# Altium project sommotor.PrjPcb (part 1 of 2)
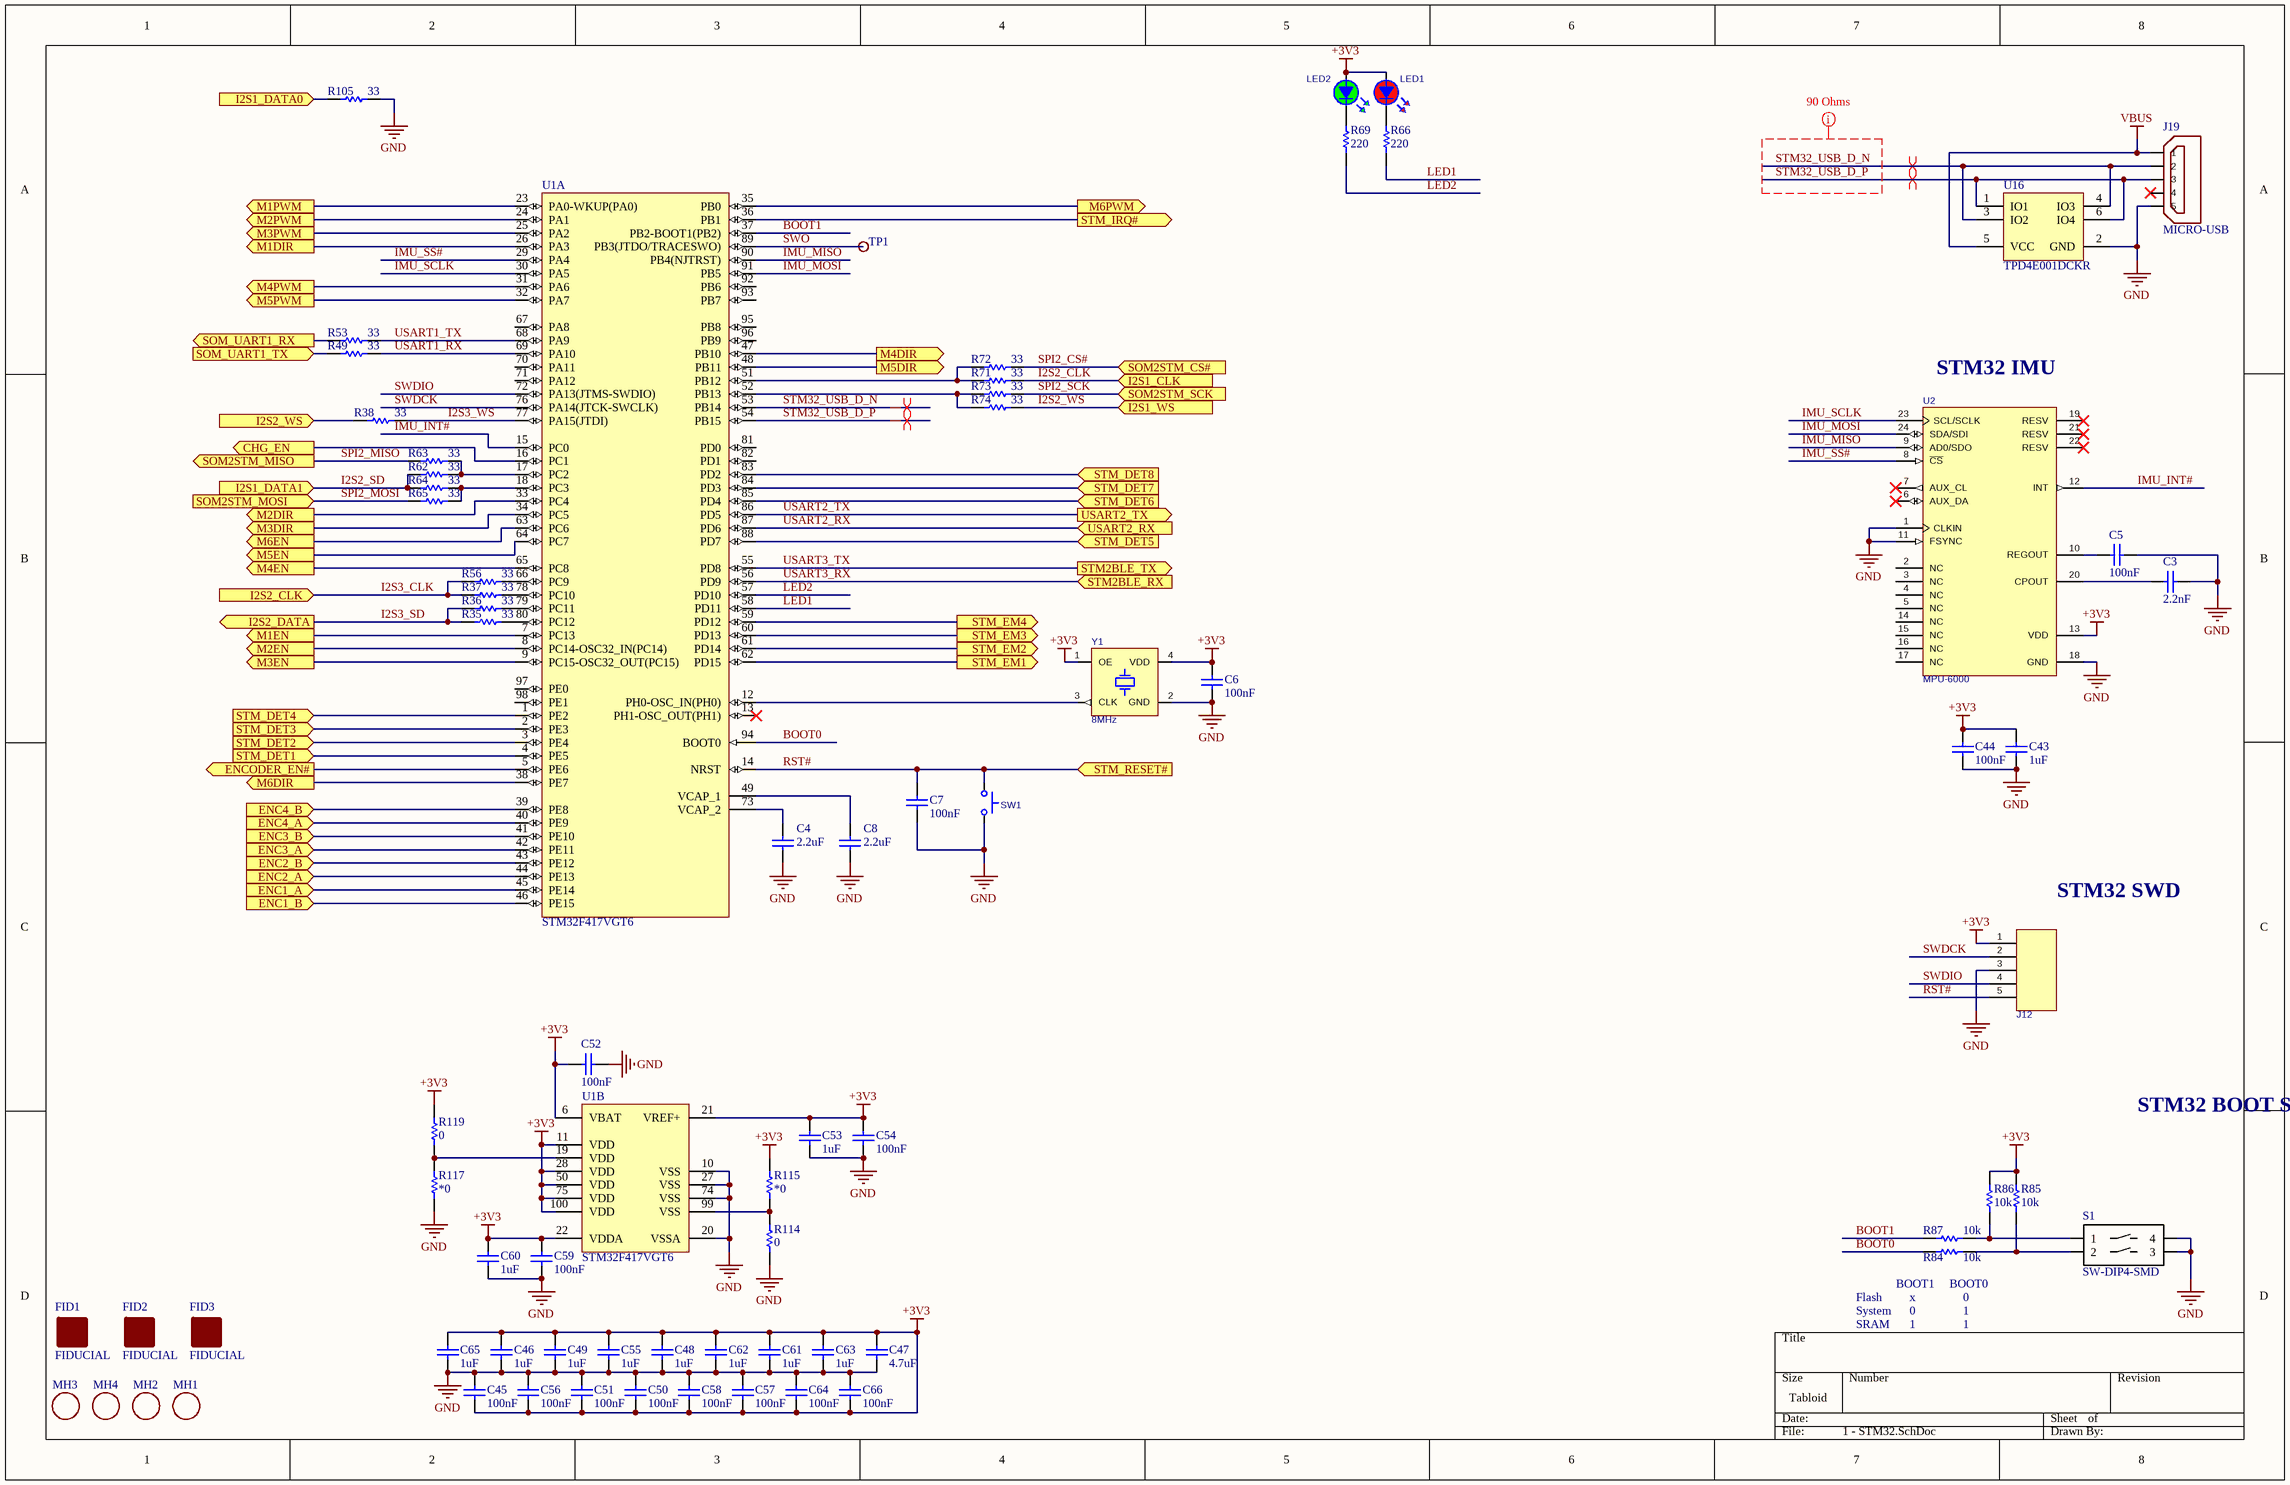
[diagram p0: 1 - STM32.SchDoc]
5 sheets, 285 parts. Net scope: flat (ports and power ports of the same name join across sheets).
Board file: sommotor.PcbDoc
Sheets:
  1 - STM32.SchDoc
  5 - PWM Steering.SchDoc
  2 - BLE.SchDoc
  3 - Motor Drivers.SchDoc
  4 - Connectors.SchDoc

## Sheet 1 - STM32.SchDoc
size Tabloid

### Parts
(Parts that share a designator on the sheet are numbered #1, #2 ... from top to bottom, then left to right.)
C3  value 2.2nF  [CAPC0805(2012)100_L]
C4  value 2.2uF  [CAPC0805(2012)100_L]  (hidden comment: CAP 2.2uF 6.3V 0805(2012))
C5  value 100nF  [CAPC0805(2012)100_L]  (hidden comment: CAP 100nF 6.3V 0805(2012))
C6  value 100nF  [CAPC0805(2012)100_L]  (hidden comment: CAP 100nF 6.3V 0805(2012))
C7  value 100nF  [CAPC0805(2012)100_L]  (hidden comment: CAP 100nF 6.3V 0805(2012))
C8  value 2.2uF  [CAPC0805(2012)100_L]  (hidden comment: CAP 2.2uF 6.3V 0805(2012))
C43  value 1uF  [CAPC0805(2012)100_L]  (hidden comment: CAP 1uF 6.3V 0805(2012))
C44  value 100nF  [CAPC0805(2012)100_L]  (hidden comment: CAP 100nF 6.3V 0805(2012))
C45  value 100nF  [CAPC0805(2012)100_L]  (hidden comment: CAP 100nF 6.3V 0805(2012))
C46  value 1uF  [CAPC0805(2012)100_L]  (hidden comment: CAP 1uF 6.3V 0805(2012))
C47  value 4.7uF  [CAPC0805(2012)100_L]  (hidden comment: CAP 4.7uF 6.3V 0805(2012))
C48  value 1uF  [CAPC0805(2012)100_L]  (hidden comment: CAP 1uF 6.3V 0805(2012))
C49  value 1uF  [CAPC0805(2012)100_L]  (hidden comment: CAP 1uF 6.3V 0805(2012))
C50  value 100nF  [CAPC0805(2012)100_L]  (hidden comment: CAP 100nF 6.3V 0805(2012))
C51  value 100nF  [CAPC0805(2012)100_L]  (hidden comment: CAP 100nF 6.3V 0805(2012))
C52  value 100nF  [CAPC0805(2012)100_L]  (hidden comment: CAP 100nF 6.3V 0805(2012))
C53  value 1uF  [CAPC0805(2012)100_L]  (hidden comment: CAP 1uF 6.3V 0805(2012))
C54  value 100nF  [CAPC0805(2012)100_L]  (hidden comment: CAP 100nF 6.3V 0805(2012))
C55  value 1uF  [CAPC0805(2012)100_L]  (hidden comment: CAP 1uF 6.3V 0805(2012))
C56  value 100nF  [CAPC0805(2012)100_L]  (hidden comment: CAP 100nF 6.3V 0805(2012))
C57  value 100nF  [CAPC0805(2012)100_L]  (hidden comment: CAP 100nF 6.3V 0805(2012))
C58  value 100nF  [CAPC0805(2012)100_L]  (hidden comment: CAP 100nF 6.3V 0805(2012))
C59  value 100nF  [CAPC0805(2012)100_L]  (hidden comment: CAP 100nF 6.3V 0805(2012))
C60  value 1uF  [CAPC0805(2012)100_L]  (hidden comment: CAP 1uF 6.3V 0805(2012))
C61  value 1uF  [CAPC0805(2012)100_L]  (hidden comment: CAP 1uF 6.3V 0805(2012))
C62  value 1uF  [CAPC0805(2012)100_L]  (hidden comment: CAP 1uF 6.3V 0805(2012))
C63  value 1uF  [CAPC0805(2012)100_L]  (hidden comment: CAP 1uF 6.3V 0805(2012))
C64  value 100nF  [CAPC0805(2012)100_L]  (hidden comment: CAP 100nF 6.3V 0805(2012))
C65  value 1uF  [CAPC0805(2012)100_L]  (hidden comment: CAP 1uF 6.3V 0805(2012))
C66  value 100nF  [CAPC0805(2012)100_L]  (hidden comment: CAP 100nF 6.3V 0805(2012))
FID1  FIDUCIAL  [FIDUCIAL]
FID2  FIDUCIAL  [FIDUCIAL]
FID3  FIDUCIAL  [FIDUCIAL]
J12  DF13-5P-1.25DS(20)  [HRS_DF13-5P-1.25DS(20)]  (value not drawn)
J19  MICRO-USB  [USB_MICRO_B_SMT]
LED1  VLMS1500-GS08  [LEDC0402(1005)_N-RED]  (value not drawn)
LED2  VLMG1500-GS08  [LEDC0402(1005)_N-GRN]  (value not drawn)
MH1  MOUNTING_HOLE125  [HOLE_MTG_125]  (value not drawn)
MH2  MOUNTING_HOLE125  [HOLE_MTG_125]  (value not drawn)
MH3  MOUNTING_HOLE125  [HOLE_MTG_125]  (value not drawn)
MH4  MOUNTING_HOLE125  [HOLE_MTG_125]  (value not drawn)
R35  value 33  [RESC0805(2012)_L]
R36  value 33  [RESC0805(2012)_L]
R37  value 33  [RESC0805(2012)_L]
R38  value 33  [RESC0805(2012)_L]
R49  value 33  [RESC0805(2012)_L]
R53  value 33  [RESC0805(2012)_L]
R56  value 33  [RESC0805(2012)_L]
R62  value 33  [RESC0805(2012)_L]
R63  value 33  [RESC0805(2012)_L]
R64  value 33  [RESC0805(2012)_L]
R65  value 33  [RESC0805(2012)_L]
R66  value 220  [RESC0805(2012)_L]
R69  value 220  [RESC0805(2012)_L]
R71  value 33  [RESC0805(2012)_L]
R72  value 33  [RESC0805(2012)_L]
R73  value 33  [RESC0805(2012)_L]
R74  value 33  [RESC0805(2012)_L]
R84  value 10k  [RESC0805(2012)_L]  (hidden comment: 10K 1% 0805(2012))
R85  value 10k  [RESC0805(2012)_L]  (hidden comment: 10K 1% 0805(2012))
R86  value 10k  [RESC0805(2012)_L]  (hidden comment: 10K 1% 0805(2012))
R87  value 10k  [RESC0805(2012)_L]  (hidden comment: 10K 1% 0805(2012))
R105  value 33  [RESC0805(2012)_L]
R114  value 0  [RESC0805(2012)_L]  (hidden comment: Jumper 0805(2012))
R115  value *0  [RESC0805(2012)_L]  (hidden comment: Jumper 0805(2012))
R117  value *0  [RESC0805(2012)_L]  (hidden comment: Jumper 0805(2012))
R119  value 0  [RESC0805(2012)_L]  (hidden comment: Jumper 0805(2012))
S1  SW-DIP4-SMD  [SO4SW]
SW1  KMR211GLFS  [KMR2]  (value not drawn)
TP1  Various test points  [TESTPOINT_035HOLE]  (value not drawn)
U1#1  STM32F417VGT6  [STM-LQFP100_M]  (part A of 2)
U1#2  STM32F417VGT6  [STM-LQFP100_M]  (part B of 2)
U2  MPU-6000  [QFN-ML24_N_NOPAD]
U16  TPD4E001DCKR  [DCK0006A_M]
Y1  8MHz  [OSC_DFN165P250X90-4N]

### Ports
CHG_EN (out), ENC1_A (in), ENC1_B (in), ENC2_A (in), ENC2_B (in), ENC3_A (in), ENC3_B (in), ENC4_A (in), ENC4_B (in), ENCODER_EN# (out), I2S1_CLK (in), I2S1_DATA0 (in), I2S1_DATA1 (in), I2S1_WS (in), I2S2_CLK (in), I2S2_DATA (out), I2S2_WS (in), M1DIR (out), M1EN (out), M1PWM (out), M2DIR (out), M2EN (out), M2PWM (out), M3DIR (out), M3EN (out), M3PWM (out), M4DIR (out), M4EN (out), M4PWM (out), M5DIR (out), M5EN (out), M5PWM (out), M6DIR (out), M6EN (out), M6PWM (out), SOM2STM_CS# (in), SOM2STM_MISO (out), SOM2STM_MOSI (in), SOM2STM_SCK (in), SOM_UART1_RX (out), SOM_UART1_TX (in), STM2BLE_RX (in), STM2BLE_TX (out), STM_DET1 (in), STM_DET2 (in), STM_DET3 (in), STM_DET4 (in), STM_DET5 (in), STM_DET6 (in), STM_DET7 (in), STM_DET8 (in), STM_EM1 (out), STM_EM2 (out), STM_EM3 (out), STM_EM4 (out), STM_IRQ# (out), STM_RESET# (in), USART2_RX (in), USART2_TX (out)

### Nets
+3V3: C6.1 C43.1 C44.1 C45.1 C46.2 C47.2 C48.2 C49.2 C50.1 C51.1 C52.1 C53.1 C54.2 C55.2 C56.1 C57.1 C58.1 C59.1 C60.1 C61.2 C62.2 C63.2 C64.1 C65.2 C66.1 J12.1 LED1.A LED2.A R85.1 R86.1 R115.2 R119.2 U1#2.6(VBAT) U1#2.11(VDD) U1#2.21(VREF+) U1#2.22(VDDA) U1#2.28(VDD) U1#2.50(VDD) U1#2.75(VDD) U1#2.100(VDD) U2.13(VDD) Y1.1(OE) Y1.4(VDD)
GND: C3.2 C4.1 C5.2 C6.2 C7.2 C8.1 C43.2 C44.2 C45.2 C46.1 C47.1 C48.1 C49.1 C50.2 C51.2 C52.2 C53.2 C54.1 C55.1 C56.2 C57.2 C58.2 C59.2 C60.2 C61.1 C62.1 C63.1 C64.2 C65.1 C66.2 J12.3 J19.ID(5) R105.1 R114.1 R117.1 S1.3 S1.4 SW1.3 U1#2.10(VSS) U1#2.20(VSSA) U1#2.27(VSS) U1#2.74(VSS) U2.1(CLKIN) U2.11(FSYNC) U2.18(GND) U16.2(GND) Y1.2(GND)
VBUS: J19.VBUS(1) U16.5(VCC)
BOOT0: R84.2 U1#1.94(BOOT0)
BOOT1: R87.2 U1#1.37(PB2-BOOT1(PB2))
I2S2_CLK: R71.1 ; port I2S1_CLK
I2S2_SD: R62.2 R64.2 ; port I2S1_DATA1
I2S2_WS: R74.1 ; port I2S1_WS
I2S3_CLK: R37.2 R56.2 ; port I2S2_CLK
I2S3_SD: R35.2 R36.2 ; port I2S2_DATA
I2S3_WS: R38.1 U1#1.77(PA15(JTDI))
IMU_INT#: U1#1.15(PC0) U2.12(INT)
IMU_MISO: U1#1.90(PB4(NJTRST)) U2.9(AD0/SDO)
IMU_MOSI: U1#1.91(PB5) U2.24(SDA/SDI)
IMU_SCLK: U1#1.30(PA5) U2.23(SCL/SCLK)
IMU_SS#: U1#1.29(PA4) U2.8(~{CS})
LED1: R66.2 U1#1.58(PD11)
LED2: R69.2 U1#1.57(PD10)
RST#: C7.1 J12.5 SW1.1 U1#1.14(NRST) ; port STM_RESET#
SPI2_CS#: R72.1 ; port SOM2STM_CS#
SPI2_MISO: R63.2 ; port SOM2STM_MISO
SPI2_MOSI: R65.2 ; port SOM2STM_MOSI
SPI2_SCK: R73.1 ; port SOM2STM_SCK
STM32_USB_D_N: J19.D-(2) U1#1.53(PB14) U16.3(IO2) U16.4(IO3)
STM32_USB_D_P: J19.D+(3) U1#1.54(PB15) U16.1(IO1) U16.6(IO4)
SWDCK: J12.2 U1#1.76(PA14(JTCK-SWCLK))
SWDIO: J12.4 U1#1.72(PA13(JTMS-SWDIO))
SWO: TP1.1 U1#1.89(PB3(JTDO/TRACESWO))
USART1_RX: R49.1 U1#1.69(PA10)
USART1_TX: R53.1 U1#1.68(PA9)
USART2_RX: U1#1.87(PD6) ; port USART2_RX
USART2_TX: U1#1.86(PD5) ; port USART2_TX
USART3_RX: U1#1.56(PD9) ; port STM2BLE_RX
USART3_TX: U1#1.55(PD8) ; port STM2BLE_TX
NetC3_1: C3.1 U2.20(CPOUT)
NetC4_2: C4.2 U1#1.73(VCAP_2)
NetC5_1: C5.1 U2.10(REGOUT)
NetC8_2: C8.2 U1#1.49(VCAP_1)
NetLED1_K: LED1.K R66.1
NetLED2_K: LED2.K R69.1
NetQ2_3: U1#1.46(PE15) ; port ENC1_B
NetQ4_3: U1#1.45(PE14) ; port ENC1_A
NetQ5_3: U1#1.43(PE12) ; port ENC2_B
NetQ7_3: U1#1.44(PE13) ; port ENC2_A
NetQ9_3: U1#1.41(PE10) ; port ENC3_B
NetQ10_3: U1#1.42(PE11) ; port ENC3_A
NetQ11_3: U1#1.39(PE8) ; port ENC4_B
NetQ12_3: U1#1.40(PE9) ; port ENC4_A
NetQ13_1: U1#1.5(PE6) ; port ENCODER_EN#
NetR21_2: U1#1.4(PE5) ; port STM_DET1
NetR22_2: U1#1.3(PE4) ; port STM_DET2
NetR23_2: U1#1.2(PE3) ; port STM_DET3
NetR24_2: U1#1.88(PD7) ; port STM_DET5
NetR25_2: U1#1.85(PD4) ; port STM_DET6
NetR26_2: U1#1.84(PD3) ; port STM_DET7
NetR27_2: U1#1.83(PD2) ; port STM_DET8
NetR28_2: U1#1.1(PE2) ; port STM_DET4
NetR30_1: U1#1.62(PD15) ; port STM_EM1
NetR35_1: R35.1 U1#1.80(PC12)
NetR36_1: R36.1 U1#1.79(PC11)
NetR37_1: R37.1 U1#1.78(PC10)
NetR38_2: R38.2 ; port I2S2_WS
NetR39_1: U1#1.61(PD14) ; port STM_EM2
NetR46_1: U1#1.60(PD13) ; port STM_EM3
NetR49_2: R49.2 ; port SOM_UART1_TX
NetR53_2: R53.2 ; port SOM_UART1_RX
NetR56_1: R56.1 U1#1.66(PC9)
NetR57_1: U1#1.59(PD12) ; port STM_EM4
NetR62_1: R62.1 R63.1 U1#1.17(PC2)
NetR64_1: R64.1 R65.1 U1#1.18(PC3)
NetR71_2: R71.2 R72.2 U1#1.51(PB12)
NetR73_2: R73.2 R74.2 U1#1.52(PB13)
NetR84_1: R84.1 R85.2 S1.2
NetR86_2: R86.2 R87.1 S1.1
NetR105_2: R105.2 ; port I2S1_DATA0
NetR111_2: U1#1.16(PC1) ; port CHG_EN
NetR114_2: R114.2 R115.1 U1#2.99(VSS)
NetR117_2: R117.2 R119.1 U1#2.19(VDD)
NetU1#1_7: U1#1.7(PC13) ; port M1EN
NetU1#1_8: U1#1.8(PC14-OSC32_IN(PC14)) ; port M2EN
NetU1#1_9: U1#1.9(PC15-OSC32_OUT(PC15)) ; port M3EN
NetU1#1_12: U1#1.12(PH0-OSC_IN(PH0)) Y1.3(CLK)
NetU1#1_23: U1#1.23(PA0-WKUP(PA0)) ; port M1PWM
NetU1#1_24: U1#1.24(PA1) ; port M2PWM
NetU1#1_25: U1#1.25(PA2) ; port M3PWM
NetU1#1_26: U1#1.26(PA3) ; port M1DIR
NetU1#1_31: U1#1.31(PA6) ; port M4PWM
NetU1#1_32: U1#1.32(PA7) ; port M5PWM
NetU1#1_33: U1#1.33(PC4) ; port M2DIR
NetU1#1_34: U1#1.34(PC5) ; port M3DIR
NetU1#1_35: U1#1.35(PB0) ; port M6PWM
NetU1#1_36: U1#1.36(PB1) ; port STM_IRQ#
NetU1#1_38: U1#1.38(PE7) ; port M6DIR
NetU1#1_47: U1#1.47(PB10) ; port M4DIR
NetU1#1_48: U1#1.48(PB11) ; port M5DIR
NetU1#1_63: U1#1.63(PC6) ; port M6EN
NetU1#1_64: U1#1.64(PC7) ; port M5EN
NetU1#1_65: U1#1.65(PC8) ; port M4EN

Not connected (* = marked no-connect by the designer): J19 GND(4)*; SW1 2 4; U1#1 13(PH1-OSC_OUT(PH1))* 67(PA8) 70(PA11) 71(PA12) 81(PD0) 82(PD1) 92(PB6) 93(PB7) 95(PB8) 96(PB9) 97(PE0) 98(PE1); U2 2(NC) 3(NC) 4(NC) 5(NC) 6(AUX_DA)* 7(AUX_CL)* 14(NC) 15(NC) 16(NC) 17(NC) 19(RESV)* 21(RESV)* 22(RESV)*

### Layout directives
differential pair: STM32_USB_D_N, STM32_USB_D_P
rule Impedance Constraint [Min = 90.00    Max = 90.00    ]: STM32_USB_D_N, STM32_USB_D_P

### Notes on the sheet
- (near U2) STM32 IMU
- (near J12) STM32 SWD
- STM32 BOOT SELECTION
- Flash
- BOOT1
- x
- BOOT0
- 0
- System
- SRAM
- 1

### Library data of the parts
C3 = CMP-1036-04520-1: CAP 220nF 6.3V Â±20% 0805 (2012 Metric) Thickness 1mm SMD; Case-Metric: 2012; Case-EIA: 0805; Technology: SMT; Tolerance: Â±20%; Max Thickness: 1 mm; Rated Voltage: 6.3 V
C4 C8 = CMP-1036-04821-1: CAP 2.2uF 6.3V Â±20% 0805 (2012 Metric) Thickness 1mm SMD; Case-EIA: 0805; Case-Metric: 2012; Rated Voltage: 6.3 V; Tolerance: Â±20%; Technology: SMT; Max Thickness: 1 mm
C5-C7 C44 C52 C59 = CMP-1036-04391-1: CAP 100nF 6.3V Â±10% 0805 (2012 Metric) Thickness 1mm SMD; Case-EIA: 0805; Case-Metric: 2012; Rated Voltage: 6.3 V; Technology: SMT; Tolerance: Â±10%; Max Thickness: 1 mm
C43 C53 C60 = CMP-1036-04730-1: CAP 1uF 6.3V Â±5% 0805 (2012 Metric) Thickness 1mm SMD; Case-Metric: 2012; Case-EIA: 0805; Technology: SMT; Tolerance: Â±5%; Max Thickness: 1 mm; Rated Voltage: 6.3 V
C45 C50 C51 C54 C56-C58 C64 C66 = CMP-1036-04392-1: CAP 100nF 6.3V Â±20% 0805 (2012 Metric) Thickness 1mm SMD; Case-Metric: 2012; Case-EIA: 0805; Max Thickness: 1 mm; Technology: SMT; Tolerance: Â±20%; Rated Voltage: 6.3 V
C46 C48 C49 C55 C61-C63 C65 = CMP-1036-04734-1: CAP 1uF 6.3V Â±20% 0805 (2012 Metric) Thickness 1mm SMD; Case-Metric: 2012; Case-EIA: 0805; Max Thickness: 1 mm; Tolerance: Â±20%; Technology: SMT; Rated Voltage: 6.3 V
C47 = CMP-1036-04879-1: CAP 4.7uF 6.3V Â±20% 0805 (2012 Metric) Thickness 1mm SMD; Case-Metric: 2012; Case-EIA: 0805; Max Thickness: 1 mm; Technology: SMT; Tolerance: Â±20%; Rated Voltage: 6.3 V
J12 = CON_HRS_DF13-5P-1.25DS(20): CONN HEADER 5POS 1.25MM R/A THT TIN; Manufacturer: Hirose Electric Co Ltd; Connector Type: Header, Shrouded; Number of Positions: 5; Number of Positions Loaded: All; Pitch: 0.049" (1.25mm); Supplier 1: Digi-Key; Manufacturer Part Number: DF13-5P-1.25DS(20); RoHS: RoHS Compliant; Category: Connectors, Interconnects; Stock 1: 10851; Pricing 1: 1=0.61, 10=0.57, 50=0.456, 100=0.437, 250=0.399, 500=0.38, 1000=0.3135, 2500=0.285, 5000=0.2755 (USD); Packaging: Tube; Contact Type: Male Pin; Number of Rows: 1; Row Spacing: -; Contact Mating Length: -; Mounting Type: Through Hole, Right Angle; Termination: Solder; Fastening Type: -; Features: Board Guide; Contact Finish: Tin; Contact Finish Thickness: -; Color: Beige; ComponentLink1URL: http://www.hirose.co.jp/cataloge_hp/2d/EDC3-081818-01.pdf; ComponentLink1Description: http://www.hirose.co.jp/cataloge_hp/2d/EDC3-081818-01.pdf; Supplier Part Number 1: H2202-ND
J19 = MICRO-USB: pin to pad: D+>3 D->2 GND>4 ID>5 VBUS>1
LED1 = LED_0402_VLMS1500-GS08: LED RED 0402 SMD; Manufacturer: Vishay Semiconductor Opto Division; Wavelength - Dominant: 631nm; Wavelength - Peak: 639nm; Millicandela Rating: 54mcd; Voltage - Forward (Vf) (Typ): 2V; Current - Test: 20mA; Viewing Angle: 130°; Lens Style/Size: Rectangle with Flat Top, 1.00mm x 0.50mm; Supplier 1: Digi-Key; Manufacturer Part Number: VLMS1500-GS08; RoHS: RoHS Compliant; Category: Optoelectronics; Stock 1: 41406; Pricing 1: 1=0.52, 10=0.384, 25=0.3072, 100=0.2035, 250=0.144, 500=0.12288, 750=0.10368, 1000=0.096 (USD); Packaging: Cut Tape (CT); Color: Red; Lens Transparency: -; Lens Color: -; Package / Case: 0402 (1005 Metric); Supplier Device Package: 0402; Size / Dimension: 1.00mm L x 0.50mm W; Height (Max): 0.35mm; Mounting Type: Surface Mount; ComponentLink1URL: http://www.vishay.com/docs/82554/vlmo1500.pdf; ComponentLink1Description: http://www.vishay.com/docs/82554/vlmo1500.pdf; Supplier Part Number 1: VLMS1500-GS08CT-ND
LED2 = LED_0402_VLMG1500-GS08: LED GREEN 0402 SMD; Manufacturer: Vishay Semiconductor Opto Division; Wavelength - Dominant: 571nm; Wavelength - Peak: 574nm; Millicandela Rating: 35mcd; Voltage - Forward (Vf) (Typ): 2V; Current - Test: 20mA; Viewing Angle: 130°; Lens Style/Size: Rectangle with Flat Top, 1.00mm x 0.50mm; Supplier 1: Digi-Key; Manufacturer Part Number: VLMG1500-GS08; RoHS: RoHS Compliant; Category: Optoelectronics; Stock 1: 37065; Pricing 1: 1=0.52, 10=0.384, 25=0.3072, 100=0.2035, 250=0.144, 500=0.12288, 750=0.10368, 1000=0.096 (USD); Packaging: Cut Tape (CT); Color: Green; Lens Transparency: -; Lens Color: -; Package / Case: 0402 (1005 Metric); Supplier Device Package: 0402; Size / Dimension: 1.00mm L x 0.50mm W; Height (Max): 0.35mm; Mounting Type: Surface Mount; ComponentLink1URL: http://www.vishay.com/docs/82554/vlmo1500.pdf; ComponentLink1Description: http://www.vishay.com/docs/82554/vlmo1500.pdf; Supplier Part Number 1: VLMG1500-GS08CT-ND
R35-R38 R49 R53 R56 R62-R65 R71-R74 R84-R87 R105 = CMP-1013-00623-1: 10K 0.125W 1% 0805 (2012 Metric)  SMD; Case-Metric: 2012; Case-EIA: 0805; Tolerance: 1 %; Power: 0.125 W; Technology: SMT
R66 R69 = CMP-1013-00623-1: 220R 0.125W 1% 0805 (2012 Metric)  SMD; Case-Metric: 2012; Case-EIA: 0805; Tolerance: 1 %; Power: 0.125 W; Technology: SMT
R114 R115 R117 R119 = CMP-1013-00001-1: Jumper 0805 (2012 Metric); Case-EIA: 0805; Tolerance: None; Case-Metric: 2012; Technology: SMT; Power: None
S1 = SW-DIP4-SMD: 2 POLE DIP SWITCH SMD
SW1 = SW_KMR211G LFS: SWITCH TACTILE SPST-NO 0.05A 32V; Manufacturer: C&K Components; Switch Function: Off-Mom; Contact Rating @ Voltage: 0.05A @ 32VDC; Actuator Type: Standard; Actuator Height off PCB, from Pins: 1.90mm; Actuator Orientation: Top Actuated; Outline: 4.60mm x 2.80mm; Illumination: Non-Illuminated; Operating Force: 120gf; Switch Travel: 0.20mm; Mechanical Life: 200,000 Cycles; Supplier 1: Digi-Key; Manufacturer Part Number: KMR211GLFS; RoHS: RoHS Compliant; Category: Switches; Stock 1: 4378; Pricing 1: 1=0.51, 10=0.493, 25=0.484, 50=0.4656, 100=0.4017, 250=0.3652, 500=0.34694, 1000=0.2739 (USD); Packaging: Cut Tape (CT); Circuit: SPST-NO; Mounting Type: Surface Mount; Termination Style: Gull Wing; Illumination Voltage (Nominal): -; Illumination Type, Color: -; Ingress Protection: -; Features: Grounding Pin; Actuator Material: -; Operating Temperature: -40°C ~ 85°C; ComponentLink1URL: http://www.ck-components.com/index.php?module=media&action=Display&cmpref=14414&lang=en&width=&height=&format=&alt=; ComponentLink1Description: http://www.ck-components.com/index.php?module=media&action=Display&cmpref=14414&lang=en&width=&height=&format=&alt=; Supplier Part Number 1: 401-1426-1-ND
TP1 = TESTPOINTHOLE035
U1#1 U1#2 = CMP-0243-00014-3: ARM Cortex-M4 32-bit MCU+FPU, 210 DMIPS, 1024 kB Flash, 192 kB Internal RAM, 82 I/Os, 100-pin LQFP, -40 to 85 degC, Tray; Manufacturer: STMicroelectronics; Operating Frequency(F) (Processor speed) (MHz): 168; Supply Voltage(Vcc) max (V): 3.6; I/Os (High Current): 82; Supply Voltage(Vcc) min (V): 1.8; FLASH Size (Prog) (kB): 1024; D/A Converter: 2x12-bit; Internal RAM Size (kB): 192; Packing: Tray; PackageReference: LQFP100; PackageDescription: 100-Pin Low Profile Quad Flat Package, 14 x 14 mm Body, 0.5 mm Pitch; DatasheetVersion: Rev. 4; Mounting Technology: Surface Mount; ComponentLink3Description: Package Specification; ComponentLink1Description: Manufacturer URL; ComponentLink2URL: http://www.st.com/st-web-ui/static/active/en/resource/technical/document/datasheet/DM00035129.pdf; ComponentLink2Description: Datasheet; PartNumber: STM32F417VGT6; Core: ARM Cortex-M4; ComponentLink3URL: http://www.st.com/st-web-ui/static/active/en/resource/technical/document/data_brief/DM00071938.pdf; ComponentLink1URL: http://www.st.com/web/en/home.html; PackageVersion: Rev. 1, 06/2013
U2 = IC_MPU-6000: GYRO/ACCELEROMETER 6AXIS 24QFN I2C/SPI; Manufacturer: InvenSense; Sensor Type: Accelerometer, Gyroscope, 3 Axis; Output Type: I²C, SPI; Supplier 1: Digi-Key; Manufacturer Part Number: MPU-6000; RoHS: RoHS Compliant; Category: Sensors, Transducers; Stock 1: 27337; Pricing 1: 1=10.72, 5=9.406, 10=8.465, 25=7.524, 50=6.9598, 100=6.0192, 250=5.83112, 500=5.643, 750=5.45491 (USD); ComponentLink1URL: http://store.invensense.com/datasheets/invensense/MPU-6050_DataSheet_V3%204.pdf; ComponentLink1Description: http://store.invensense.com/datasheets/invensense/MPU-6050_DataSheet_V3%204.pdf; Supplier Part Number 1: 1428-1005-1-ND
U16 = CMP-0326-00066-2: Low-Capacitance + / - 15-kV ESD Protection Array for High-Speed Data Interfaces, 4 Channels, -40 to +85 degC, 6-pin SOT70 (DCK), Green (RoHS & no Sb/Br); Manufacturer: Texas Instruments; IO Leakage Current(nA): 1.5; IEC 61000-4-2 Air-Gap(+/- kV): 15; USB High Speed: TRUE; SubFamily: ESD Solution; IEC 61000-4-2 Contact(+/- kV): 8; Breakdown Voltage(Min)(V): 11; Mounting Technology: Surface Mount; DatasheetVersion: SLLS682G; ComponentLink1URL: http://www.ti.com/; Serial ATA / eSATA: TRUE; PackageReference: DCK0006A; ComponentLink3Description: URL Link1; ComponentLink2Description: Datasheet; 1394 / Firewire: TRUE; ComponentLink2URL: http://www.ti.com/general/docs/lit/getliterature.tsp?genericPartNumber=TPD4E001&fileType=pdf; ComponentLink1Description: Manufacturer URL; PackageVersion: revG, Jan-2007; ComponentLink3URL: SamplesURL:http://www.ti.com/product/tpd4e001#samples; PackageDescription: 6-Pin Plastic Small-Outline Package, 2 x 1.3 mm Body, 0.65 mm Pitch, 2.1 mm Lead Span; IO Capacitance(Typ)(pF): 1.5; PartNumber: TPD4E001DCKR; Eco-Plan: Green (RoHS & no Sb/Br)
Y1 = OSC_MEMS_8.000MHZ: OSC CMEMS 8.000MHZ LVCMOS SMD; Manufacturer: Silicon Labs; Manufacturer Part Number: 501ABA8M00000DAG; Function: Tri-State (Output Enable); Voltage - Supply: 1.7 V ~ 3.6 V; Frequency Stability: ±30ppm; Current - Supply (Max): 2.5mA; Supplier 1: Digi-Key; RoHS: RoHS Compliant; Category: Crystals and Oscillators; Stock 1: 150; Pricing 1: 1=1.04, 10=0.92, 50=0.86, 100=0.76, 500=0.72, 1000=0.6, 2500=0.58, 5000=0.56 (USD); Packaging: Cut Strip; Type: CMEMS®; Frequency: 8MHz; Output: LVCMOS; Operating Temperature: -40°C ~ 85°C; Ratings: -; Mounting Type: Surface Mount; Size / Dimension: 0.098" L x 0.079" W (2.50mm x 2.00mm); Height: 0.035" (0.90mm); Package / Case: 4-SMD, No Lead (DFN, LCC); Current - Supply (Disable) (Max): 2.5mA; ComponentLink1URL: http://www.silabs.com/Support%20Documents/TechnicalDocs/Si501-2-3.pdf; ComponentLink1Description: http://www.silabs.com/Support%20Documents/TechnicalDocs/Si501-2-3.pdf; Supplier Part Number 1: 336-2873-ND

## Sheet 5 - PWM Steering.SchDoc
size Tabloid
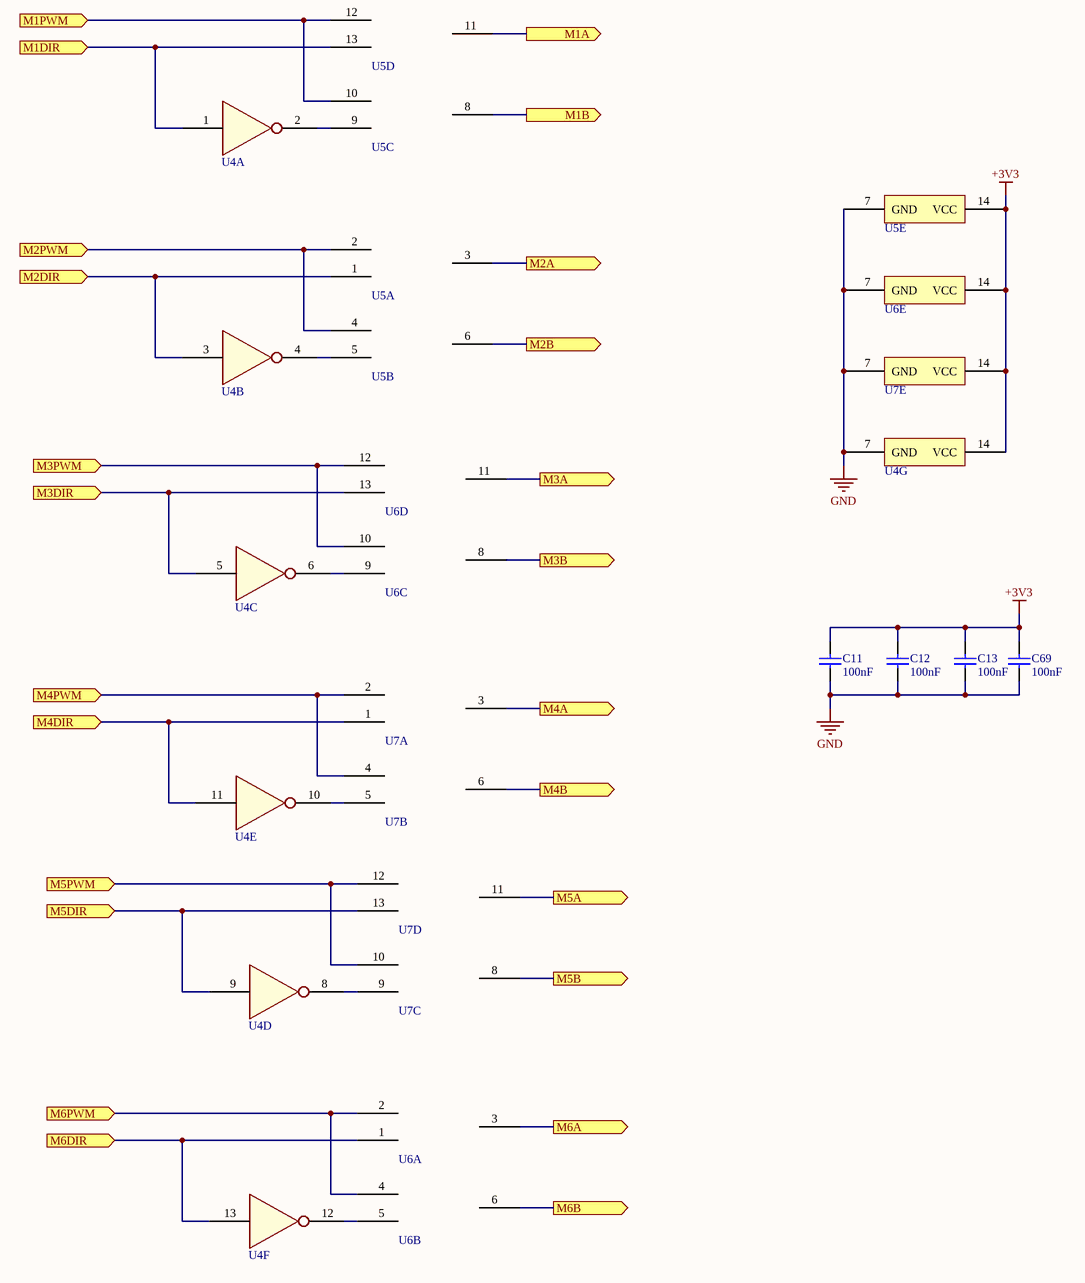
[diagram p1: 5 - PWM Steering.SchDoc]

### Parts
C11  value 100nF  [CAPC0805(2012)100_L]  (hidden comment: CAP 100nF 6.3V 0805(2012))
C12  value 100nF  [CAPC0805(2012)100_L]  (hidden comment: CAP 100nF 6.3V 0805(2012))
C13  value 100nF  [CAPC0805(2012)100_L]  (hidden comment: CAP 100nF 6.3V 0805(2012))
C69  value 100nF  [CAPC0805(2012)100_L]  (hidden comment: CAP 100nF 6.3V 0805(2012))
U4  Hex Inverter  [QFN50P300X250X100-15T110X160N]  (value not drawn)  (parts A,B,C,D,E,F,G of 7)
U5  Quad 2-Input AND Gate  [QFN50P300X250X100-15T110X160N]  (value not drawn)  (parts A,B,C,D,E of 5)
U6  Quad 2-Input AND Gate  [QFN50P300X250X100-15T110X160N]  (value not drawn)  (parts A,B,C,D,E of 5)
U7  Quad 2-Input AND Gate  [QFN50P300X250X100-15T110X160N]  (value not drawn)  (parts A,B,C,D,E of 5)

### Ports
M1A (out), M1B (out), M1DIR (in), M1PWM (in), M2A (out), M2B (out), M2DIR (in), M2PWM (in), M3A (out), M3B (out), M3DIR (in), M3PWM (in), M4A (out), M4B (out), M4DIR (in), M4PWM (in), M5A (out), M5B (out), M5DIR (in), M5PWM (in), M6A (out), M6B (out), M6DIR (in), M6PWM (in)

### Nets
+3V3: C11.2 C12.2 C13.2 C69.2 U4.14(VCC) U5.14(VCC) U6.14(VCC) U7.14(VCC)
GND: C11.1 C12.1 C13.1 C69.1 U4.7(GND) U5.7(GND) U6.7(GND) U7.7(GND)
NetU1#1_23: U5.10(3B) U5.12(4A) ; port M1PWM
NetU1#1_24: U5.2(1B) U5.4(2A) ; port M2PWM
NetU1#1_25: U6.10(3B) U6.12(4A) ; port M3PWM
NetU1#1_26: U4.1(1A) U5.13(4B) ; port M1DIR
NetU1#1_31: U7.2(1B) U7.4(2A) ; port M4PWM
NetU1#1_32: U7.10(3B) U7.12(4A) ; port M5PWM
NetU1#1_33: U4.3(2A) U5.1(1A) ; port M2DIR
NetU1#1_34: U4.5(3A) U6.13(4B) ; port M3DIR
NetU1#1_35: U6.2(1B) U6.4(2A) ; port M6PWM
NetU1#1_38: U4.13(6A) U6.1(1A) ; port M6DIR
NetU1#1_47: U4.11(5A) U7.1(1A) ; port M4DIR
NetU1#1_48: U4.9(4A) U7.13(4B) ; port M5DIR
NetU4_2: U4.2(1Y) U5.9(3A)
NetU4_4: U4.4(2Y) U5.5(2B)
NetU4_6: U4.6(3Y) U6.9(3A)
NetU4_8: U4.8(4Y) U7.9(3A)
NetU4_10: U4.10(5Y) U7.5(2B)
NetU4_12: U4.12(6Y) U6.5(2B)
NetU5_3: U5.3(1Y) ; port M2A
NetU5_6: U5.6(2Y) ; port M2B
NetU5_8: U5.8(3Y) ; port M1B
NetU5_11: U5.11(4Y) ; port M1A
NetU6_3: U6.3(1Y) ; port M6A
NetU6_6: U6.6(2Y) ; port M6B
NetU6_8: U6.8(3Y) ; port M3B
NetU6_11: U6.11(4Y) ; port M3A
NetU7_3: U7.3(1Y) ; port M4A
NetU7_6: U7.6(2Y) ; port M4B
NetU7_8: U7.8(3Y) ; port M5B
NetU7_11: U7.11(4Y) ; port M5A

### Library data of the parts
C11-C13 C69 = CMP-1036-04391-1: as C5 on sheet 1 - STM32; Rated Voltage: 6.3 V; Technology: SMT; Tolerance: Â±10%; Max Thickness: 1 mm
U4 = 74LVC04A
U5-U7 = 74LVC08A

## Sheet 2 - BLE.SchDoc
size Tabloid
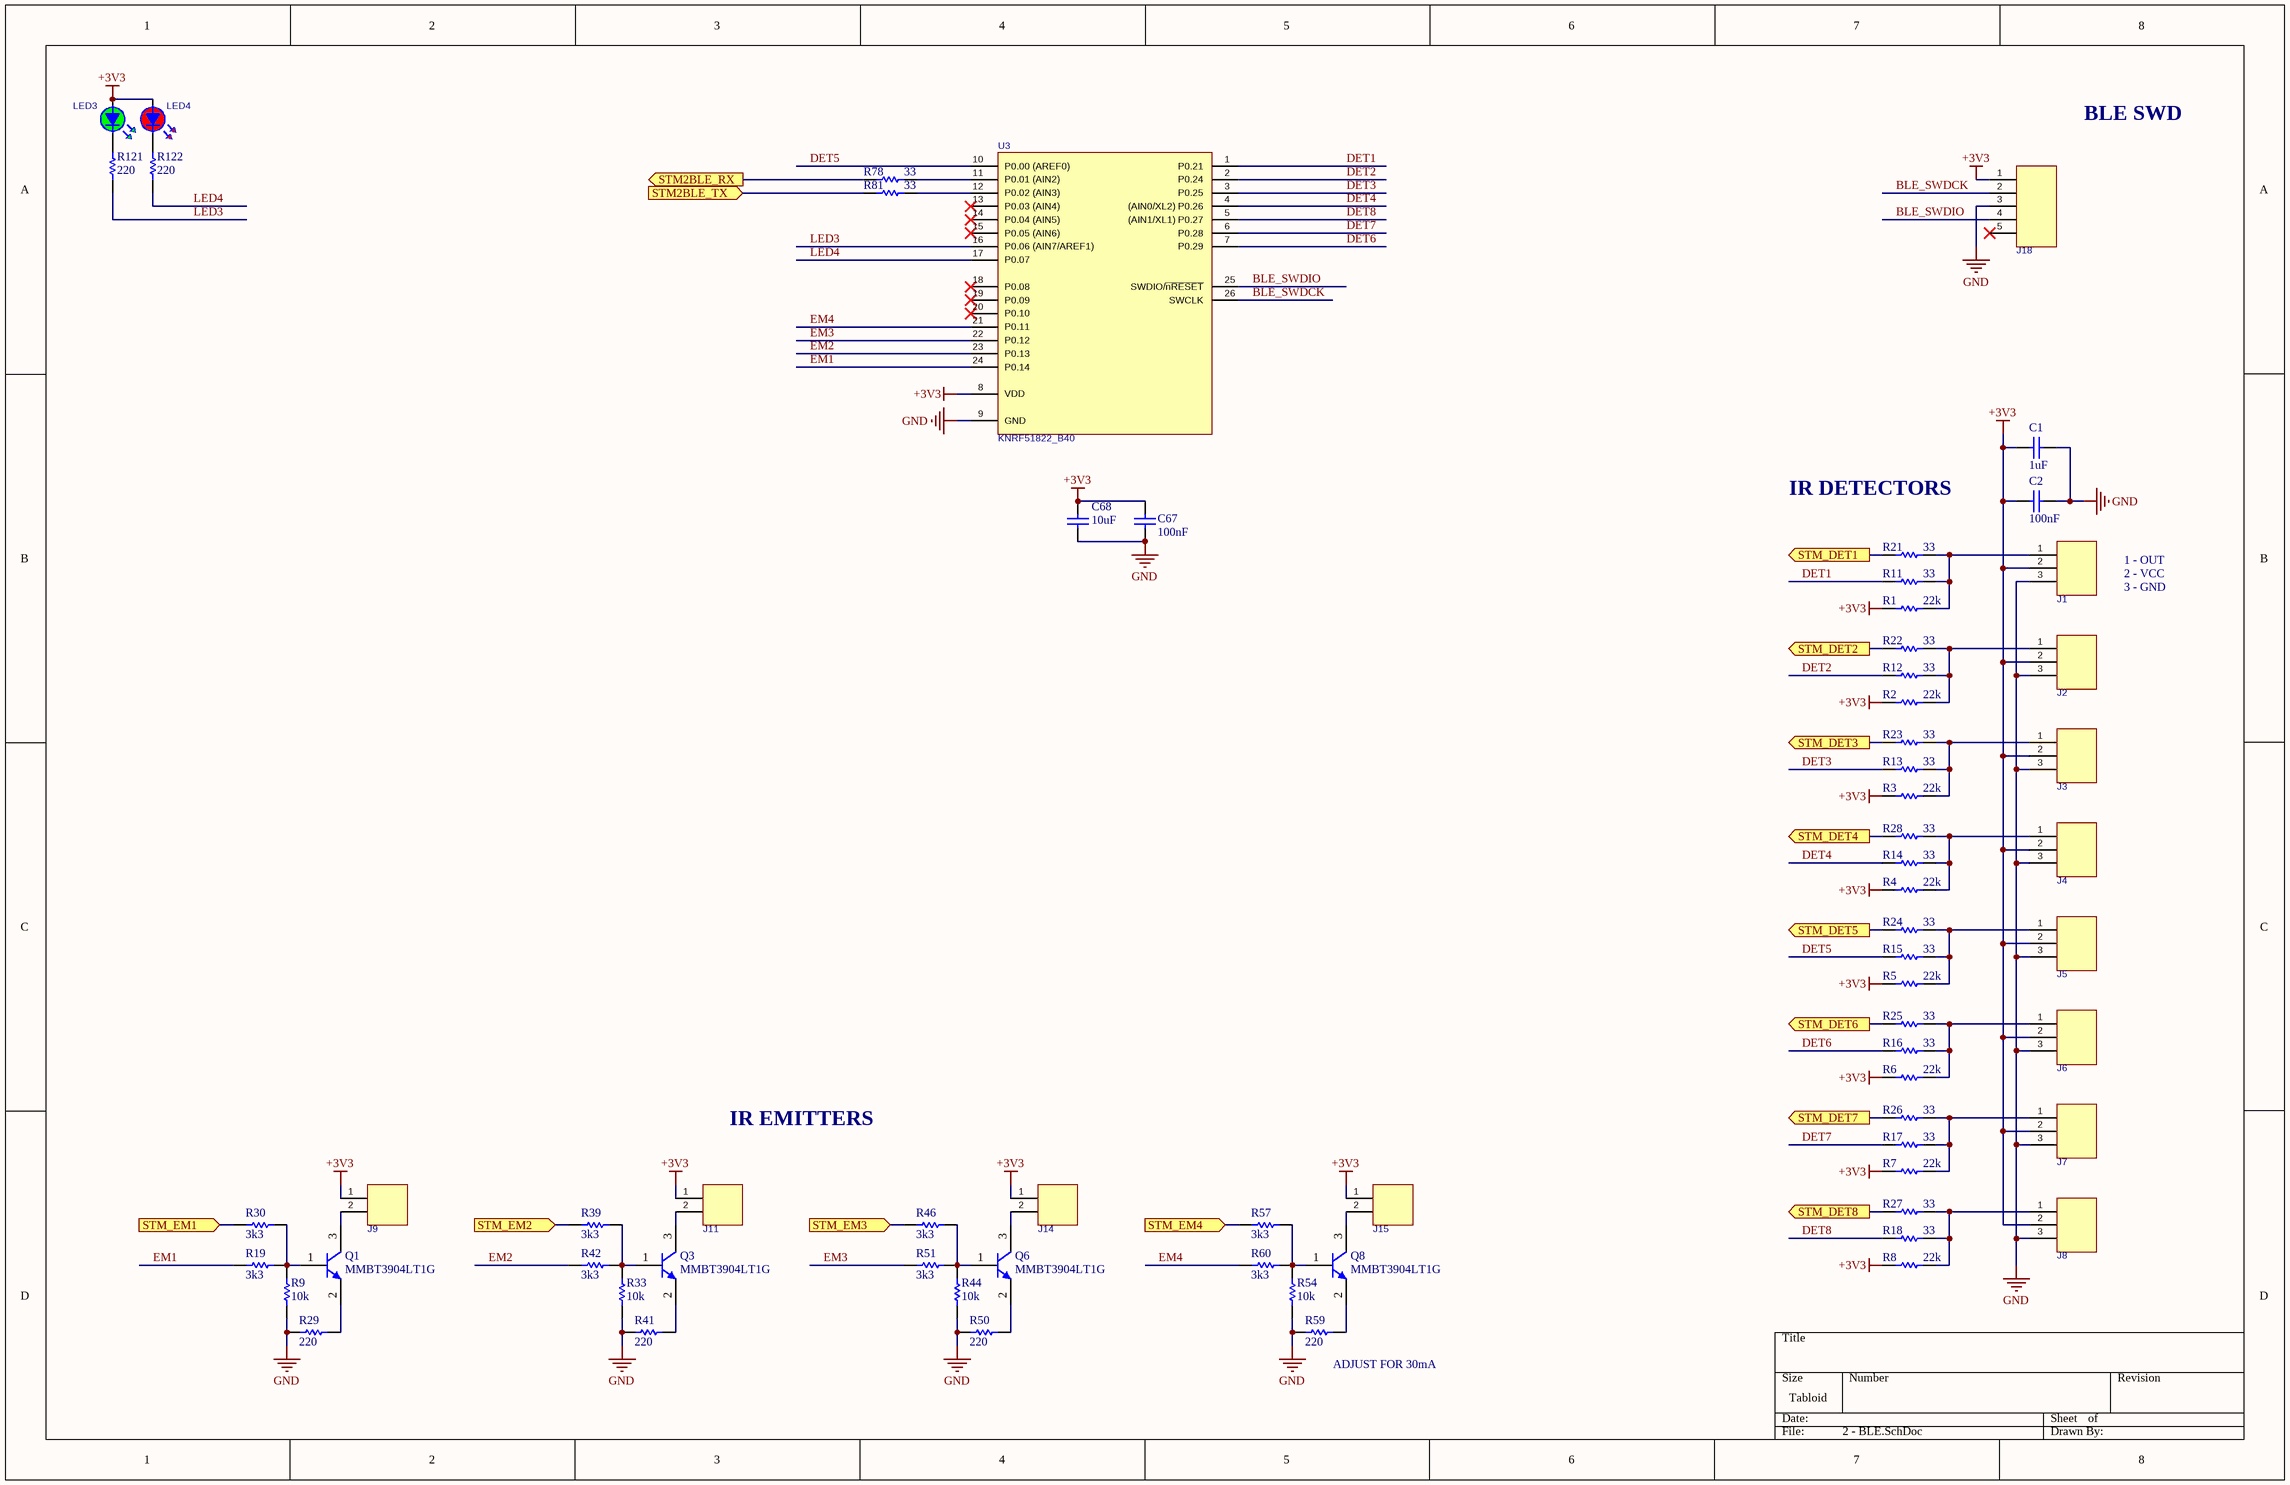
[diagram p2: 2 - BLE.SchDoc]

### Parts
C1  value 1uF  [CAPC0805(2012)100_L]  (hidden comment: CAP 1uF 6.3V 0805(2012))
C2  value 100nF  [CAPC0805(2012)100_L]  (hidden comment: CAP 100nF 6.3V 0805(2012))
C67  value 100nF  [CAPC0805(2012)100_N]  (hidden comment: CAP 100nF 6.3V 0805(2012))
C68  value 10uF  [CAPC0805(2012)100_N]  (hidden comment: CAP 10uF 6.3V 0805(2012))
J1  DF13-3P-1.25DS(20)  [HRS_DF13-3P-1.25DS(20)]  (value not drawn)
J2  DF13-3P-1.25DS(20)  [HRS_DF13-3P-1.25DS(20)]  (value not drawn)
J3  DF13-3P-1.25DS(20)  [HRS_DF13-3P-1.25DS(20)]  (value not drawn)
J4  DF13-3P-1.25DS(20)  [HRS_DF13-3P-1.25DS(20)]  (value not drawn)
J5  DF13-3P-1.25DS(20)  [HRS_DF13-3P-1.25DS(20)]  (value not drawn)
J6  DF13-3P-1.25DS(20)  [HRS_DF13-3P-1.25DS(20)]  (value not drawn)
J7  DF13-3P-1.25DS(20)  [HRS_DF13-3P-1.25DS(20)]  (value not drawn)
J8  DF13-3P-1.25DS(20)  [HRS_DF13-3P-1.25DS(20)]  (value not drawn)
J9  DF13-2P-1.25DS(20)  [HRS_DF13-2P-1.25DS(20)]  (value not drawn)
J11  DF13-2P-1.25DS(20)  [HRS_DF13-2P-1.25DS(20)]  (value not drawn)
J14  DF13-2P-1.25DS(20)  [HRS_DF13-2P-1.25DS(20)]  (value not drawn)
J15  DF13-2P-1.25DS(20)  [HRS_DF13-2P-1.25DS(20)]  (value not drawn)
J18  DF13-5P-1.25DS(20)  [HRS_DF13-5P-1.25DS(20)]  (value not drawn)
LED3  VLMG1500-GS08  [LEDC0402(1005)_N-GRN]  (value not drawn)
LED4  VLMS1500-GS08  [LEDC0402(1005)_N-RED]  (value not drawn)
Q1  MMBT3904LT1G  [ONSC-SOT-23-3-318-08_V]
Q3  MMBT3904LT1G  [ONSC-SOT-23-3-318-08_V]
Q6  MMBT3904LT1G  [ONSC-SOT-23-3-318-08_V]
Q8  MMBT3904LT1G  [ONSC-SOT-23-3-318-08_V]
R1  value 22k  [RESC0805(2012)_L]  (hidden comment: 22K 1% 0805(2012))
R2  value 22k  [RESC0805(2012)_L]  (hidden comment: 22K 1% 0805(2012))
R3  value 22k  [RESC0805(2012)_L]  (hidden comment: 22K 1% 0805(2012))
R4  value 22k  [RESC0805(2012)_L]  (hidden comment: 22K 1% 0805(2012))
R5  value 22k  [RESC0805(2012)_L]  (hidden comment: 22K 1% 0805(2012))
R6  value 22k  [RESC0805(2012)_L]  (hidden comment: 22K 1% 0805(2012))
R7  value 22k  [RESC0805(2012)_L]  (hidden comment: 22K 1% 0805(2012))
R8  value 22k  [RESC0805(2012)_L]  (hidden comment: 22K 1% 0805(2012))
R9  value 10k  [RESC0805(2012)_L]  (hidden comment: 10K 1% 0805(2012))
R11  value 33  [RESC0805(2012)_L]
R12  value 33  [RESC0805(2012)_L]
R13  value 33  [RESC0805(2012)_L]
R14  value 33  [RESC0805(2012)_L]
R15  value 33  [RESC0805(2012)_L]
R16  value 33  [RESC0805(2012)_L]
R17  value 33  [RESC0805(2012)_L]
R18  value 33  [RESC0805(2012)_L]
R19  value 3k3  [RESC0805(2012)_L]  (hidden comment: 3K3 1% 0805(2012))
R21  value 33  [RESC0805(2012)_L]
R22  value 33  [RESC0805(2012)_L]
R23  value 33  [RESC0805(2012)_L]
R24  value 33  [RESC0805(2012)_L]
R25  value 33  [RESC0805(2012)_L]
R26  value 33  [RESC0805(2012)_L]
R27  value 33  [RESC0805(2012)_L]
R28  value 33  [RESC0805(2012)_L]
R29  value 220  [RESC0805(2012)_L]  (hidden comment: 220R 1% 0805(2012))
R30  value 3k3  [RESC0805(2012)_L]  (hidden comment: 3K3 1% 0805(2012))
R33  value 10k  [RESC0805(2012)_L]  (hidden comment: 10K 1% 0805(2012))
R39  value 3k3  [RESC0805(2012)_L]  (hidden comment: 3K3 1% 0805(2012))
R41  value 220  [RESC0805(2012)_L]  (hidden comment: 220R 1% 0805(2012))
R42  value 3k3  [RESC0805(2012)_L]  (hidden comment: 3K3 1% 0805(2012))
R44  value 10k  [RESC0805(2012)_L]  (hidden comment: 10K 1% 0805(2012))
R46  value 3k3  [RESC0805(2012)_L]  (hidden comment: 3K3 1% 0805(2012))
R50  value 220  [RESC0805(2012)_L]  (hidden comment: 220R 1% 0805(2012))
R51  value 3k3  [RESC0805(2012)_L]  (hidden comment: 3K3 1% 0805(2012))
R54  value 10k  [RESC0805(2012)_L]  (hidden comment: 10K 1% 0805(2012))
R57  value 3k3  [RESC0805(2012)_L]  (hidden comment: 3K3 1% 0805(2012))
R59  value 220  [RESC0805(2012)_L]  (hidden comment: 220R 1% 0805(2012))
R60  value 3k3  [RESC0805(2012)_L]  (hidden comment: 3K3 1% 0805(2012))
R78  value 33  [RESC0805(2012)_L]
R81  value 33  [RESC0805(2012)_L]
R121  value 220  [RESC0805(2012)_L]
R122  value 220  [RESC0805(2012)_L]
U3  KNRF51822_B40  [MOD_KnRF51822_B40]

### Ports
STM2BLE_RX (out), STM2BLE_TX (in), STM_DET1 (out), STM_DET2 (out), STM_DET3 (out), STM_DET4 (out), STM_DET5 (out), STM_DET6 (out), STM_DET7 (out), STM_DET8 (out), STM_EM1 (in), STM_EM2 (in), STM_EM3 (in), STM_EM4 (in)

### Nets
+3V3: C1.1 C2.1 C67.1 C68.2 J1.2 J2.2 J3.2 J4.2 J5.2 J6.2 J7.2 J8.2 J9.1 J11.1 J14.1 J15.1 J18.1 LED3.A LED4.A R1.2 R2.2 R3.2 R4.2 R5.2 R6.2 R7.2 R8.2 U3.8(VDD)
GND: C1.2 C2.2 C67.2 C68.1 J1.3 J2.3 J3.3 J4.3 J5.3 J6.3 J7.3 J8.3 J18.3 R9.1 R29.2 R33.1 R41.2 R44.1 R50.2 R54.1 R59.2 U3.9(GND)
BLE_SWDCK: J18.2 U3.26(SWCLK)
BLE_SWDIO: J18.4 U3.25(SWDIO/~{nRESET})
DET1: R11.2 U3.1(P0.21)
DET2: R12.2 U3.2(P0.24)
DET3: R13.2 U3.3(P0.25)
DET4: R14.2 U3.4((AIN0/XL2)_P0.26)
DET5: R15.2 U3.10(P0.00_(AREF0))
DET6: R16.2 U3.7(P0.29)
DET7: R17.2 U3.6(P0.28)
DET8: R18.2 U3.5((AIN1/XL1)_P0.27)
EM1: R19.1 U3.24(P0.14)
EM2: R42.1 U3.23(P0.13)
EM3: R51.1 U3.22(P0.12)
EM4: R60.1 U3.21(P0.11)
LED3: R121.2 U3.16(P0.06_(AIN7/AREF1))
LED4: R122.2 U3.17(P0.07)
USART3_RX: R78.2 ; port STM2BLE_RX
USART3_TX: R81.2 ; port STM2BLE_TX
NetJ1_1: J1.1 R1.1 R11.1 R21.1
NetJ2_1: J2.1 R2.1 R12.1 R22.1
NetJ3_1: J3.1 R3.1 R13.1 R23.1
NetJ4_1: J4.1 R4.1 R14.1 R28.1
NetJ5_1: J5.1 R5.1 R15.1 R24.1
NetJ6_1: J6.1 R6.1 R16.1 R25.1
NetJ7_1: J7.1 R7.1 R17.1 R26.1
NetJ8_1: J8.1 R8.1 R18.1 R27.1
NetJ9_2: J9.2 Q1.3(C)
NetJ11_2: J11.2 Q3.3(C)
NetJ14_2: J14.2 Q6.3(C)
NetJ15_2: J15.2 Q8.3(C)
NetLED3_K: LED3.K R121.1
NetLED4_K: LED4.K R122.1
NetQ1_1: Q1.1(B) R9.2 R19.2 R30.2
NetQ1_2: Q1.2(E) R29.1
NetQ3_1: Q3.1(B) R33.2 R39.2 R42.2
NetQ3_2: Q3.2(E) R41.1
NetQ6_1: Q6.1(B) R44.2 R46.2 R51.2
NetQ6_2: Q6.2(E) R50.1
NetQ8_1: Q8.1(B) R54.2 R57.2 R60.2
NetQ8_2: Q8.2(E) R59.1
NetR21_2: R21.2 ; port STM_DET1
NetR22_2: R22.2 ; port STM_DET2
NetR23_2: R23.2 ; port STM_DET3
NetR24_2: R24.2 ; port STM_DET5
NetR25_2: R25.2 ; port STM_DET6
NetR26_2: R26.2 ; port STM_DET7
NetR27_2: R27.2 ; port STM_DET8
NetR28_2: R28.2 ; port STM_DET4
NetR30_1: R30.1 ; port STM_EM1
NetR39_1: R39.1 ; port STM_EM2
NetR46_1: R46.1 ; port STM_EM3
NetR57_1: R57.1 ; port STM_EM4
NetR78_1: R78.1 U3.11(P0.01_(AIN2))
NetR81_1: R81.1 U3.12(P0.02_(AIN3))

Not connected (* = marked no-connect by the designer): J18 5*; U3 13(P0.03_(AIN4))* 14(P0.04_(AIN5))* 15(P0.05_(AIN6))* 18(P0.08)* 19(P0.09)* 20(P0.10)*

### Notes on the sheet
- BLE SWD
- IR DETECTORS
- 1 - OUT
- 2 - VCC
- 3 - GND
- IR EMITTERS
- (near R59) ADJUST FOR 30mA

### Library data of the parts
C1 = CMP-1036-04730-1: as C43 on sheet 1 - STM32; Technology: SMT; Tolerance: Â±5%; Max Thickness: 1 mm; Rated Voltage: 6.3 V
C2 C67 = CMP-1036-04391-1: as C5 on sheet 1 - STM32; Rated Voltage: 6.3 V; Technology: SMT; Tolerance: Â±10%; Max Thickness: 1 mm
C68 = CMP-1036-04920-1: CAP 10uF 6.3V Â±20% 0805 (2012 Metric) Thickness 1mm SMD; Case-Metric: 2012; Case-EIA: 0805; Max Thickness: 1 mm; Tolerance: Â±20%; Rated Voltage: 6.3 V; Technology: SMT
J1-J8 = CON_HRS_DF13-3P-1.25DS(20): CONN HEADER 3POS 1.25MM R/A THT TIN; Manufacturer: Hirose Electric Co Ltd; Connector Type: Header, Shrouded; Number of Positions: 3; Number of Positions Loaded: All; Pitch: 0.049" (1.25mm); Manufacturer Part Number: DF13-3P-1.25DS(20); RoHS: RoHS Compliant; Category: Connectors, Interconnects; Packaging: Tube; Contact Type: Male Pin; Number of Rows: 1; Row Spacing: -; Contact Mating Length: -; Mounting Type: Through Hole, Right Angle; Termination: Solder; Fastening Type: -; Features: Board Guide; Contact Finish: Tin; Contact Finish Thickness: -; Color: Beige; ComponentLink1URL: http://www.hirose.co.jp/cataloge_hp/2d/EDC3-081817-01.pdf; ComponentLink1Description: http://www.hirose.co.jp/cataloge_hp/2d/EDC3-081817-01.pdf
J9 J11 J14 J15 = CON_HRS_DF13-2P-1.25DS(20): CONN HEADER 2POS 1.25MM R/A THT TIN; Manufacturer: Hirose Electric Co Ltd; Connector Type: Header, Shrouded; Number of Positions: 2; Number of Positions Loaded: All; Pitch: 0.049" (1.25mm); Manufacturer Part Number: DF13-2P-1.25DS(20); RoHS: RoHS Compliant; Category: Connectors, Interconnects; Packaging: Tube; Contact Type: Male Pin; Number of Rows: 1; Row Spacing: -; Contact Mating Length: -; Mounting Type: Through Hole, Right Angle; Termination: Solder; Fastening Type: -; Features: Board Guide; Contact Finish: Tin; Contact Finish Thickness: -; Color: Beige; ComponentLink1URL: http://www.hirose.co.jp/cataloge_hp/2d/EDC3-081817-01.pdf; ComponentLink1Description: http://www.hirose.co.jp/cataloge_hp/2d/EDC3-081817-01.pdf
J18 = CON_HRS_DF13-5P-1.25DS(20): as J12 on sheet 1 - STM32; Supplier 1: Digi-Key; Manufacturer Part Number: DF13-5P-1.25DS(20); RoHS: RoHS Compliant; Category: Connectors, Interconnects; Stock 1: 10851; Pricing 1: 1=0.61, 10=0.57, 50=0.456, 100=0.437, 250=0.399, 500=0.38, 1000=0.3135, 2500=0.285, 5000=0.2755 (USD); Packaging: Tube; Contact Type: Male Pin; Number of Rows: 1; Row Spacing: -; Contact Mating Length: -; Mounting Type: Through Hole, Right Angle; Termination: Solder; Fastening Type: -; Features: Board Guide; Contact Finish: Tin; Contact Finish Thickness: -; Color: Beige; ComponentLink1URL: http://www.hirose.co.jp/cataloge_hp/2d/EDC3-081818-01.pdf; ComponentLink1Description: http://www.hirose.co.jp/cataloge_hp/2d/EDC3-081818-01.pdf; Supplier Part Number 1: H2202-ND
LED3 = LED_0402_VLMG1500-GS08: as LED2 on sheet 1 - STM32; Supplier 1: Digi-Key; Manufacturer Part Number: VLMG1500-GS08; RoHS: RoHS Compliant; Category: Optoelectronics; Stock 1: 37065; Pricing 1: 1=0.52, 10=0.384, 25=0.3072, 100=0.2035, 250=0.144, 500=0.12288, 750=0.10368, 1000=0.096 (USD); Packaging: Cut Tape (CT); Color: Green; Lens Transparency: -; Lens Color: -; Package / Case: 0402 (1005 Metric); Supplier Device Package: 0402; Size / Dimension: 1.00mm L x 0.50mm W; Height (Max): 0.35mm; Mounting Type: Surface Mount; ComponentLink1URL: http://www.vishay.com/docs/82554/vlmo1500.pdf; ComponentLink1Description: http://www.vishay.com/docs/82554/vlmo1500.pdf; Supplier Part Number 1: VLMG1500-GS08CT-ND
LED4 = LED_0402_VLMS1500-GS08: as LED1 on sheet 1 - STM32; Supplier 1: Digi-Key; Manufacturer Part Number: VLMS1500-GS08; RoHS: RoHS Compliant; Category: Optoelectronics; Stock 1: 41406; Pricing 1: 1=0.52, 10=0.384, 25=0.3072, 100=0.2035, 250=0.144, 500=0.12288, 750=0.10368, 1000=0.096 (USD); Packaging: Cut Tape (CT); Color: Red; Lens Transparency: -; Lens Color: -; Package / Case: 0402 (1005 Metric); Supplier Device Package: 0402; Size / Dimension: 1.00mm L x 0.50mm W; Height (Max): 0.35mm; Mounting Type: Surface Mount; ComponentLink1URL: http://www.vishay.com/docs/82554/vlmo1500.pdf; ComponentLink1Description: http://www.vishay.com/docs/82554/vlmo1500.pdf; Supplier Part Number 1: VLMS1500-GS08CT-ND
Q1 Q3 Q6 Q8 = CMP-1048-00631-1: General Purpose Transistor, NPN Silicon, 3-Pin SOT-23, Pb-Free, Tape and Reel; Manufacturer: On Semiconductor; IC Continuous (A): 0.2; fT Min (MHz): 300; ComponentLink2Description: Datasheet; Polarity: NPN; PackageDescription: 3-Pin Small Outline Transistor, Body 2.92 x 1.3 mm, Pitch 0.95 mm; ComponentLink2URL: http://www.onsemi.cn/pub_link/Collateral/MMBT3904LT1-D.PDF; DatasheetVersion: Rev. 12; Mounting Technology: Surface Mount; PartNumber: MMBT3904LT1G; ComponentLink1URL: http://www.onsemi.com/; ComponentLink3Description: Package Specification; ComponentLink1Description: Manufacturer URL; PackageVersion: Rev. AP, 11/2009; PackageReference: SOT-23-3-318-08; Packing: Tape and Reel; ComponentLink3URL: http://www.onsemi.cn/pub_link/Collateral/318-08.PDF; RoHS: TRUE
R1-R8 = CMP-1013-00659-1: 22K 0.125W 1% 0805 (2012 Metric)  SMD; Case-EIA: 0805; Case-Metric: 2012; Tolerance: 1 %; Technology: SMT; Power: 0.125 W
R9 R11-R18 R21-R28 R33 R44 R54 R78 R81 = CMP-1013-00623-1: as R35 on sheet 1 - STM32; Tolerance: 1 %; Power: 0.125 W; Technology: SMT
R19 R30 R39 R42 R46 R51 R57 R60 = CMP-1013-00567-1: 3K3 0.125W 1% 0805 (2012 Metric)  SMD; Case-Metric: 2012; Case-EIA: 0805; Technology: SMT; Tolerance: 1 %; Power: 0.125 W
R29 R41 R50 R59 = CMP-1013-00433-1: 220R 0.125W 1% 0805 (2012 Metric)  SMD; Case-EIA: 0805; Case-Metric: 2012; Technology: SMT; Tolerance: 1 %; Power: 0.125 W
R121 R122 = CMP-1013-00623-1: as R66 on sheet 1 - STM32; Tolerance: 1 %; Power: 0.125 W; Technology: SMT
U3 = RF_KNRF51822_B40: BLE / MULTI-PROTOCOL 2.4GHz RF MODULE; Manufacturer: NST; Supply Voltage: 1.8 - 3.6V; Current consumption: 11.8mA typ; PCB Size: 13.5mm x 16.2mm; Frequency range: 2400 – 2483.5 MHz; Tx power: 4 dBm; Rx sensitivity: -93 dBm typ.; Antenna: PCB Antenna; Core IC: Nordic nRF51822; Manufacturer Part Number: KNRF51822_B40; Operating temperature: -25 to +75°C